# EasyEDA schematic ESQUEMATICO.json
TITLE: Modelo A para Pluviómetro; REV: 1.0; Date: 2021-03-16; Sheet: 1/1; Drawn By: rommelts coyo; Company: Practica región de Aysén
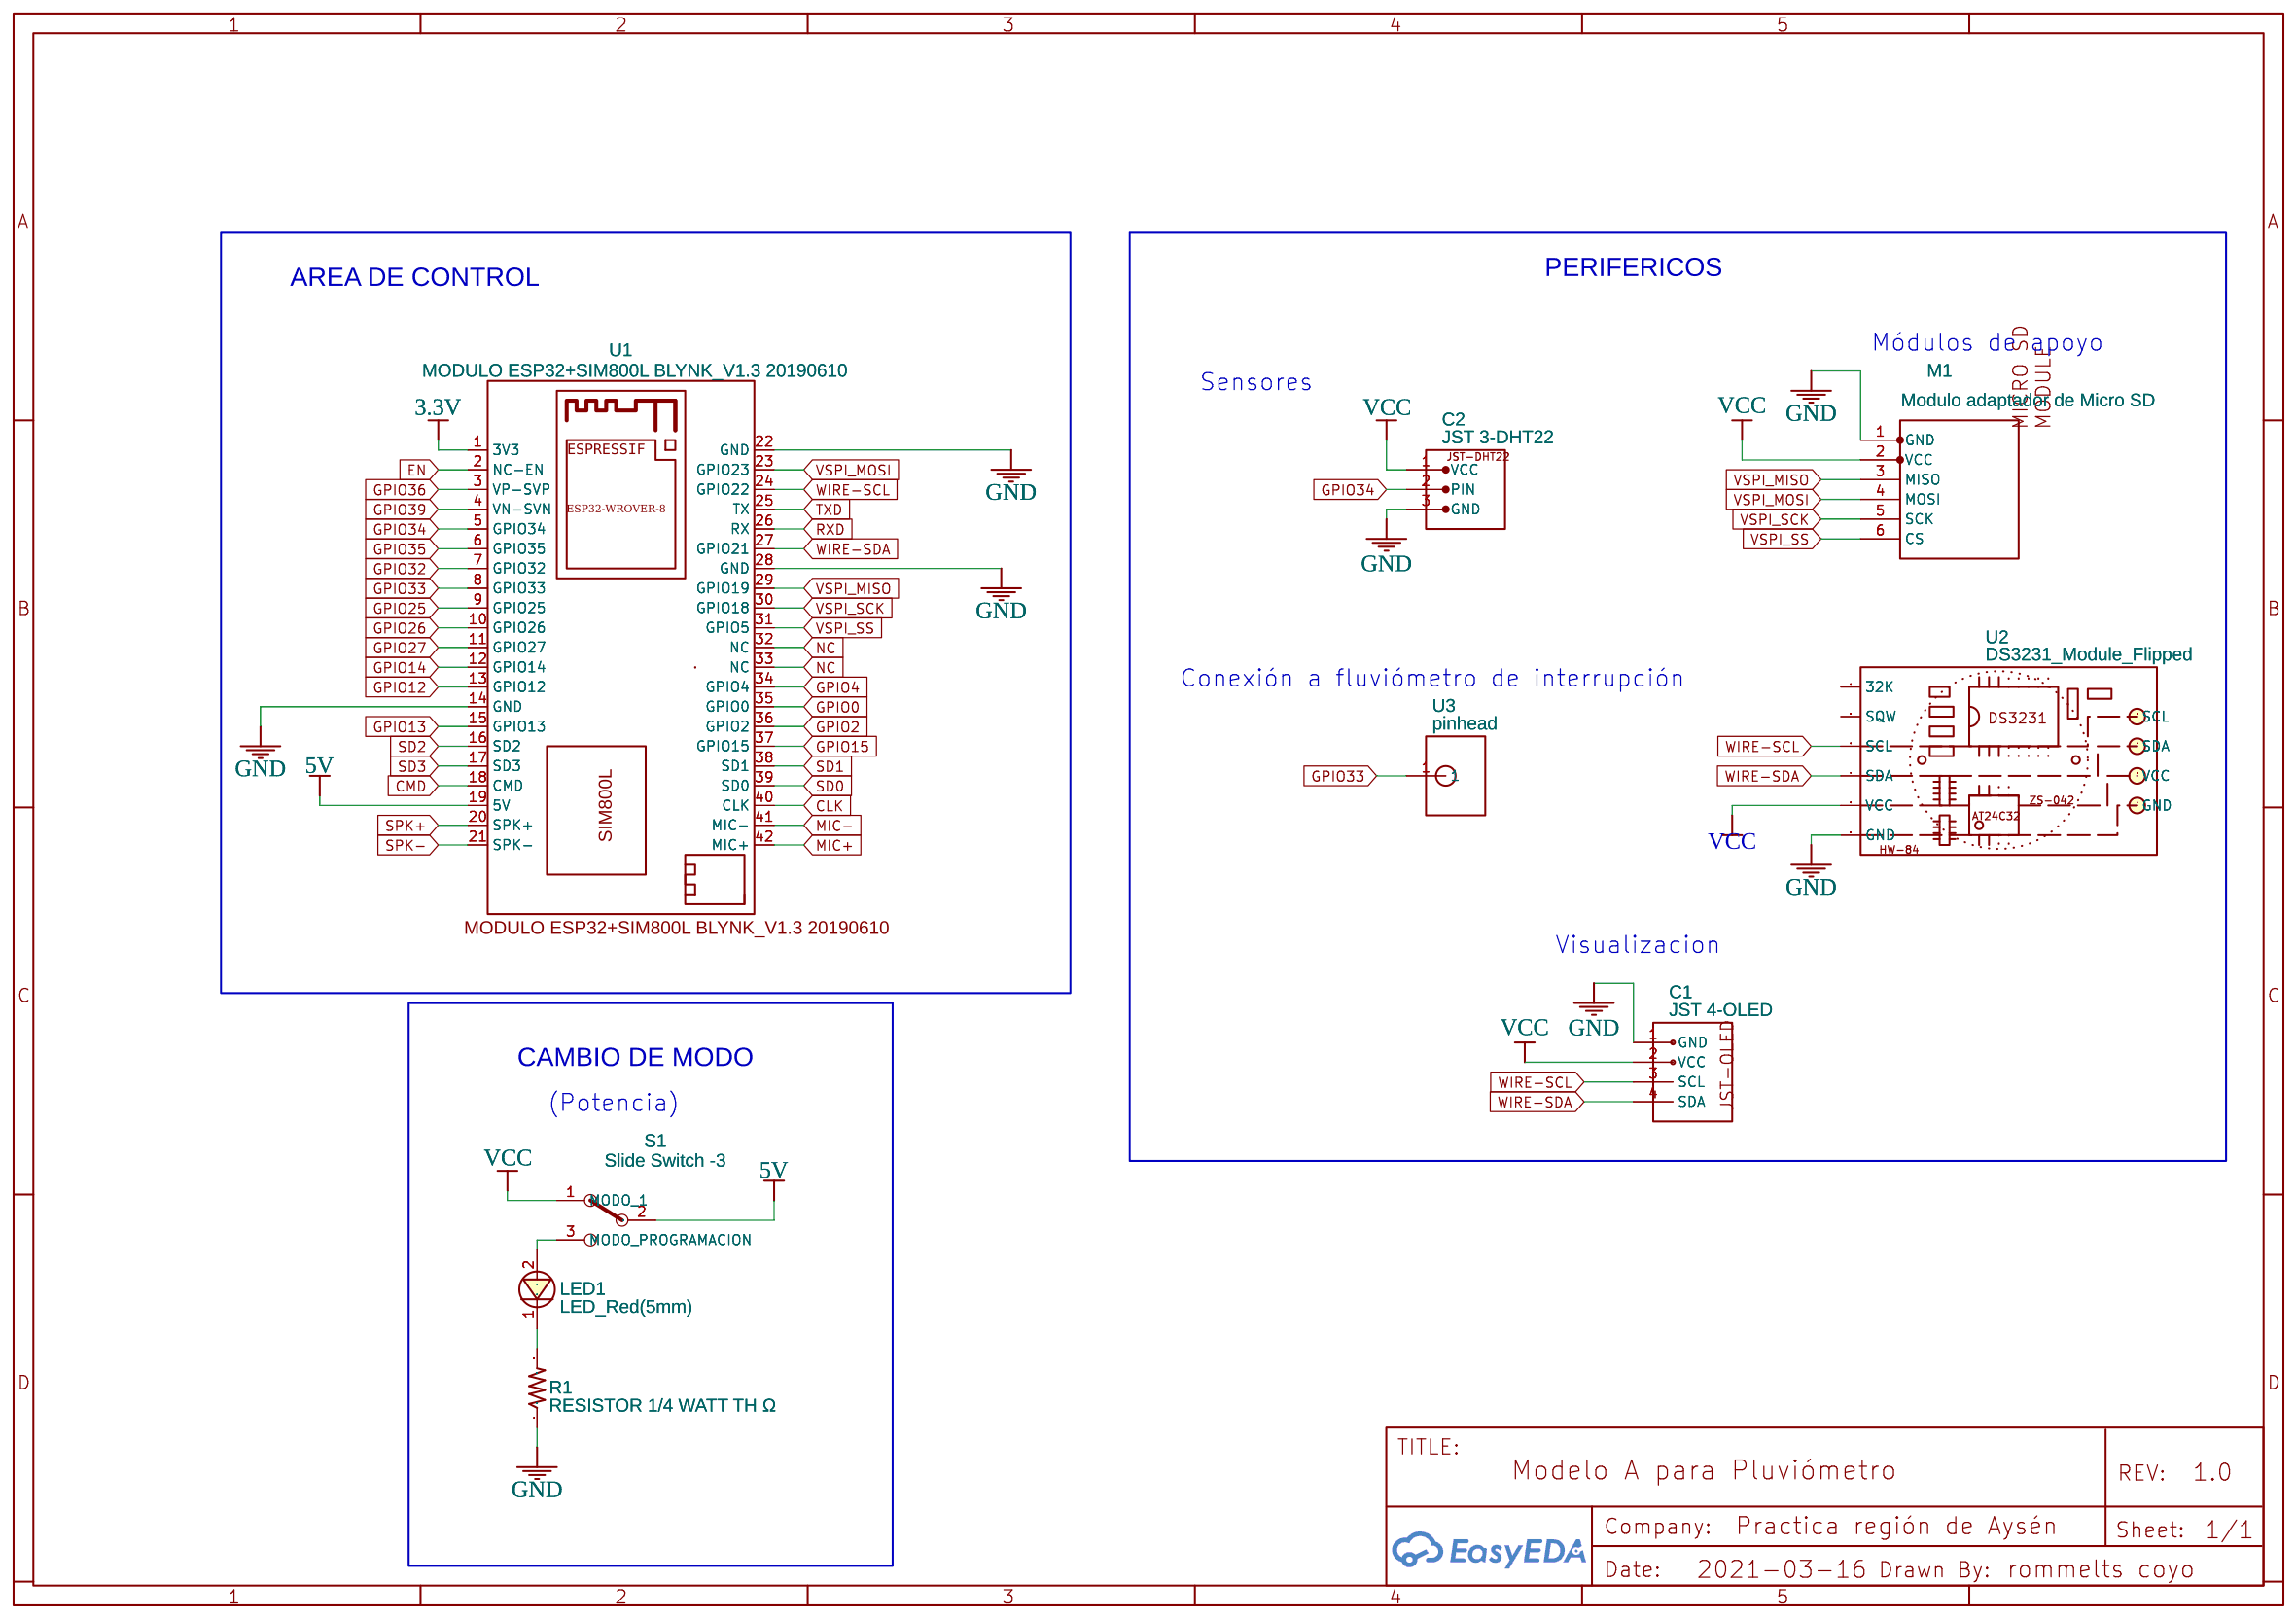
[diagram p0: schematic sheet]

## Parts
C1  JST 4-OLED  [CONECTOR JST4]
C2  JST 3-DHT22  [JST3 DHT22]
LED1  LED_Red(5mm)  [LED 5MM_M]
M1  Modulo adaptador de Micro SD  [MICRO SD CARD MODULE]
R1  RESISTOR 1/4 WATT TH Ω  [RESISTOR_1/4_WATT_TH]
S1  Slide Switch -3  [SLIDE SWITCH -3]
U1  MODULO ESP32+SIM800L BLYNK_V1.3 20190610  [MODULO ESP32+SIM800L BLYNK_V1.3 20190610]
U2  DS3231_Module_Flipped  [DS3231_MODULE_FLIPPED]
U3  pinhead  [PINHEAD]

## Library data of the parts
C1 = JST 4-OLED: link: https://www.digikey.com/en/resources/datasheets/jst/xh-connector; Contributor: rommeltscoyo.calle
C2 = JST 3-DHT22: link: https://www.digikey.com/en/resources/datasheets/jst/xh-connector; Contributor: rommeltscoyo.calle
LED1 = LED_Red(5mm): Manufacturer Part: LED 5MM; Contributor: michaelmchen
M1 = Modulo adaptador de Micro SD: Contributor: rommelts coyo
R1 = RESISTOR 1/4 WATT TH Ω: Mounted: Yes
S1 = Slide Switch -3: link: https://www.digikey.com/en/datasheets/apeminc/apem-inc-slide_switches; Contributor: rommeltscoyo.calle
U1 = MODULO ESP32+SIM800L BLYNK_V1.3 20190610: Contributor: rommeltscoyo.calle; Package Display: Yes
U2 = DS3231_Module_Flipped: Contributor: Krystian
U3 = pinhead: Contributor: rommeltscoyo.calle

## Nets
3.3V: U1.1(3V3)
5V: S1.2(NC) U1.19(5V)
GND: C1.1(GND) C2.3(GND) M1.1(GND) R1.1 U1.14(GND) U1.22(GND) U1.28(GND) U2.6(GND)
VCC: C1.2(VCC) C2.1(VCC) M1.2(VCC) S1.1(MODO 1) U2.5(VCC)
CLK: U1.40(CLK)
CMD: U1.18(CMD)
EN: U1.2(NC-EN)
GPIO0: U1.35(GPIO0)
GPIO2: U1.36(GPIO2)
GPIO4: U1.34(GPIO4)
GPIO12: U1.13(GPIO12)
GPIO13: U1.15(GPIO13)
GPIO14: U1.12(GPIO14)
GPIO15: U1.37(GPIO15)
GPIO25: U1.9(GPIO25)
GPIO26: U1.10(GPIO26)
GPIO27: U1.11(GPIO27)
GPIO32: U1.7(GPIO32)
GPIO33: U1.8(GPIO33) U3.1
GPIO34: C2.2(PIN) U1.5(GPIO34)
GPIO35: U1.6(GPIO35)
GPIO36: U1.3(VP-SVP)
GPIO39: U1.4(VN-SVN)
MIC+: U1.42(MIC+)
MIC-: U1.41(MIC-)
NC: U1.32(NC) U1.33(NC)
RXD: U1.26(RX)
SD0: U1.39(SD0)
SD1: U1.38(SD1)
SD2: U1.16(SD2)
SD3: U1.17(SD3)
SPK+: U1.20(SPK+)
SPK-: U1.21(SPK-)
TXD: U1.25(TX)
VSPI_MISO: M1.3(MISO) U1.29(GPIO19)
VSPI_MOSI: M1.4(MOSI) U1.23(GPIO23)
VSPI_SCK: M1.5(SCK) U1.30(GPIO18)
VSPI_SS: M1.6(CS) U1.31(GPIO5)
WIRE-SCL: C1.3(SCL) U1.24(GPIO22) U2.3(SCL)
WIRE-SDA: C1.4(SDA) U1.27(GPIO21) U2.4(SDA)
Net-(LED1-1): LED1.1(K) R1.2
Net-(LED1-2): LED1.2(A) S1.3(MODO PROGRAMACION)

Not connected (* = marked no-connect by the designer): U2 1(32K) 2(SQW) 7(GND) 8(VCC) 9(SDA) 10(SCL)

## Notes on the sheet
- AREA DE CONTROL
- PERIFERICOS
- Módulos de apoyo
- Sensores
- Conexión a fluviómetro de interrupción
- Visualizacion
- CAMBIO DE MODO
- (Potencia)
